# EAGLE schematic pin_matrix_schematic (EAGLE 9.6.2)
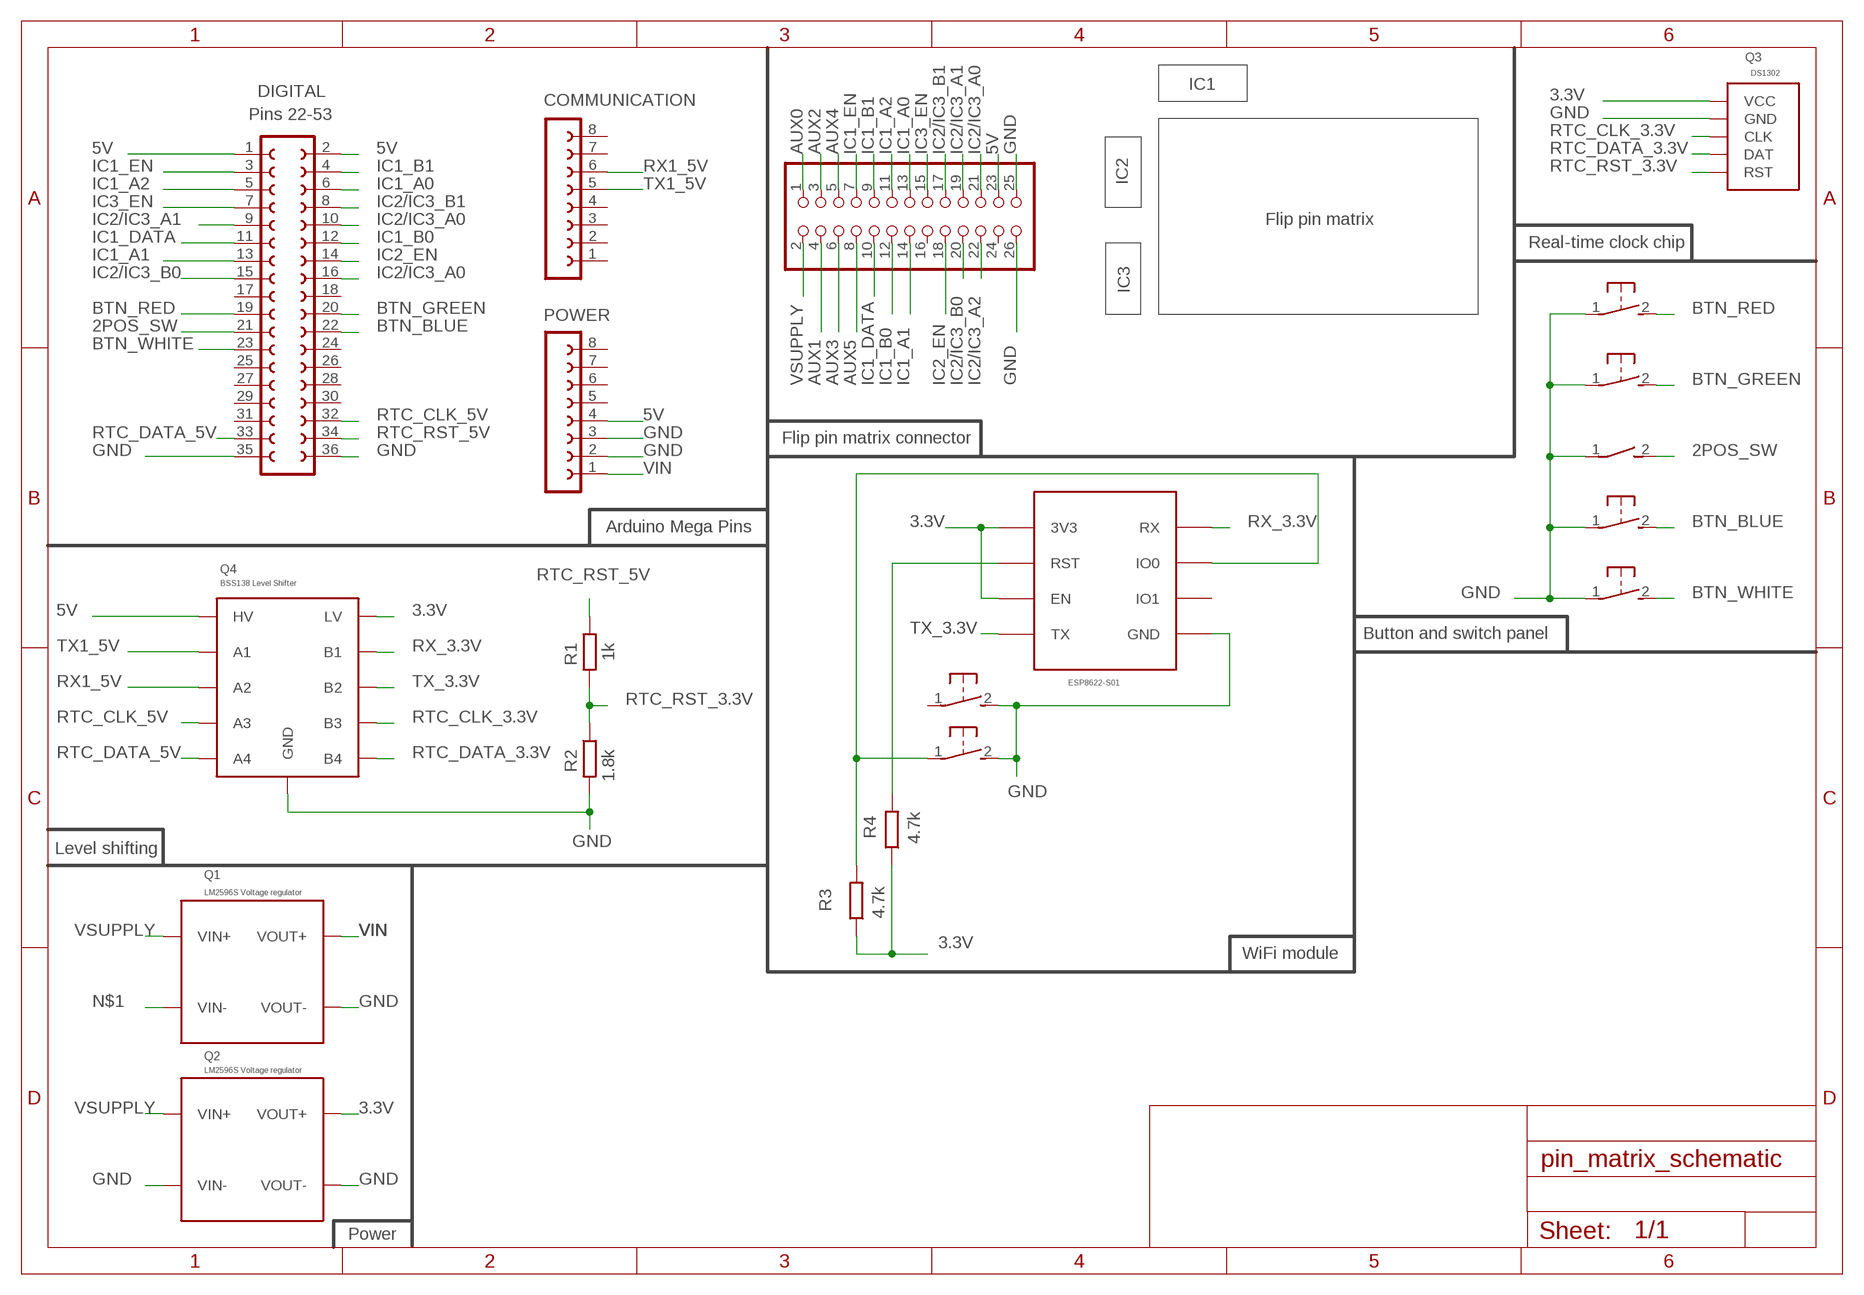
[diagram p0: schematic, sheet 1]

## Parts
COMMUNICATION  FE08-1  [FE08]
DIGITAL  Pins 22-53  FE18-2  [FE18-2]
JP1  PINHD-2X13  [2X13]
POWER  FE08-1  [FE08]
Q1  LM2596S-DCDC-BRD  [LM2596S-FOOT]
Q2  LM2596S-DCDC-BRD  [LM2596S-FOOT]
Q3  DS1302-BRD  [DS1302-FOOT]
Q4  BSS138-4CH-LVL-BRD  [BSS138-LVL-FOOT]
Q5  ESP1866-01S  [ESP8622-01S-FOOT]
R1  1k  R-EU_0204/7  [0204/7]
R2  1.8k  R-EU_0204/7  [0204/7]
R3  4.7k  R-EU_0204/7  [0204/7]
R4  4.7k  R-EU_0204/7  [0204/7]
S1  DS01E  [DS-01]
S2  31-XX  [B3F-31XX]
S3  31-XX  [B3F-31XX]
S4  31-XX  [B3F-31XX]
S5  31-XX  [B3F-31XX]
S6  31-XX  [B3F-31XX]
S7  31-XX  [B3F-31XX]

## Nets
2POS_SW: DIGITAL.21 S1.2
3.3V: Q2.VOUT+ Q3.VCC Q4.LV Q5.3V3 Q5.EN R3.1 R4.1
5V: DIGITAL.1 DIGITAL.2 JP1.23 POWER.4 Q4.HV
AUX0: JP1.1
AUX1: JP1.4
AUX2: JP1.3
AUX3: JP1.6
AUX4: JP1.5
AUX5: JP1.8
BTN_BLUE: DIGITAL.22 S4.2(S)
BTN_GREEN: DIGITAL.20 S3.2(S)
BTN_RED: DIGITAL.19 S2.2(S)
BTN_WHITE: DIGITAL.23 S5.2(S)
GND: DIGITAL.35 DIGITAL.36 JP1.25 JP1.26 POWER.2 POWER.3 Q1.VOUT- Q2.VIN- Q2.VOUT- Q3.GND Q4.GND_HV(GND) Q4.GND_LV(GND) Q5.GND R2.2 S1.1 S2.1(P) S3.1(P) S4.1(P) S5.1(P) S6.2(S) S7.2(S)
IC1_A0: DIGITAL.6 JP1.13
IC1_A1: DIGITAL.13 JP1.14
IC1_A2: DIGITAL.5 JP1.11
IC1_B0: DIGITAL.12 JP1.12
IC1_B1: DIGITAL.4 JP1.9
IC1_DATA: DIGITAL.11 JP1.10
IC1_EN: DIGITAL.3 JP1.7
IC2/IC3_A0: DIGITAL.10 DIGITAL.16 JP1.21
IC2/IC3_A1: DIGITAL.9 JP1.19
IC2/IC3_A2: JP1.22
IC2/IC3_B0: DIGITAL.15 JP1.20
IC2/IC3_B1: DIGITAL.8 JP1.17
IC2_EN: DIGITAL.14 JP1.18
IC3_EN: DIGITAL.7 JP1.15
N$1: Q1.VIN-
N$3: Q5.RST R4.2
N$4: Q5.IO0 R3.2 S6.1(P)
RTC_CLK_3.3V: Q3.CLK Q4.B3
RTC_CLK_5V: DIGITAL.32 Q4.A3
RTC_DATA_3.3V: Q3.DAT Q4.B4
RTC_DATA_5V: DIGITAL.33 Q4.A4
RTC_RST_3.3V: Q3.RST R1.2 R2.1
RTC_RST_5V: DIGITAL.34 R1.1
RX1_5V: COMMUNICATION.6 Q4.A2
RX_3.3V: Q4.B1 Q5.RX
TX1_5V: COMMUNICATION.5 Q4.A1
TX_3.3V: Q4.B2 Q5.TX
VIN: POWER.1 Q1.VOUT+
VSUPPLY: JP1.2 Q1.VIN+ Q2.VIN+
Unconnected: COMMUNICATION.1 COMMUNICATION.2 COMMUNICATION.3 COMMUNICATION.4 COMMUNICATION.7 COMMUNICATION.8 DIGITAL.17 DIGITAL.18 DIGITAL.24 DIGITAL.25 DIGITAL.26 DIGITAL.27 DIGITAL.28 DIGITAL.29 DIGITAL.30 DIGITAL.31 JP1.16 JP1.24 POWER.5 POWER.6 POWER.7 POWER.8 Q5.IO1 S7.1(P)

## Notes on the sheet
- DS1302
- IC1
- IC2
- Flip pin matrix
- Real-time clock chip
- IC3
- Flip pin matrix connector
- Arduino Mega Pins
- BSS138 Level Shifter
- Button and switch panel
- ESP8622-S01
- Level shifting
- LM2596S Voltage regulator
- WiFi module
- LM2596S Voltage regulator
- Power

## Library data of the parts
COMMUNICATION POWER = con-lsta:FE08-1: FEMALE HEADER; OC_FARNELL: unknown; OC_NEWARK: unknown
DIGITAL = con-lsta:FE18-2: FEMALE HEADER; OC_FARNELL: unknown; OC_NEWARK: unknown
JP1 = pinhead:PINHD-2X13: PIN HEADER
Q1 Q2 = custom_components:LM2596S-DCDC-BRD: LM2596S DC-DC Buck Converter Voltage regulator board based on the LM2596S integrated circuit. Vin: 3.2V - 46V DC Vout: 1.25 - 35V DC
Q3 = custom_components:DS1302-BRD: DS1302 Real-time clock board A real-time clock board based on the DS1302 circuit. Keep the time when disconnected using an CR2032 battery.
Q4 = custom_components:BSS138-4CH-LVL-BRD: BSS138 4-Channel Level Shifter A 4-channel level shifter board using the BSS138 transistor.
Q5 = custom_components:ESP1866-01S: ESP8622-01S A circuit board based on the RSP8622 WiFi module.
R1-R4 = rcl:R-EU_: RESISTOR, European symbol; SPICEPREFIX: R
S1 = switch-dil:DS01E: DIL/CODE SWITCH; OC_FARNELL: unknown; OC_NEWARK: unknown
S2-S7 = switch-omron:31-XX: OMRON SWITCH; MPN: B3F-3100; OC_FARNELL: 959704; OC_NEWARK: 36M3582